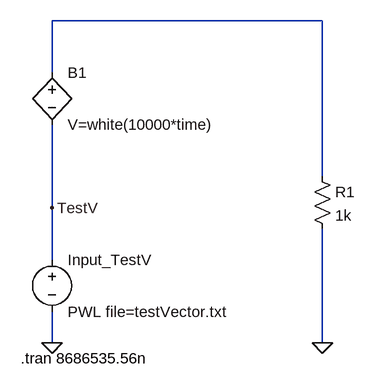
[diagram p0: schematic eye-diagram-pwl.asc]
eye-diagram-pwl.asc, the LTspice schematic file:
Version 4
SHEET 1 880 680
WIRE 464 -240 48 -240
WIRE 48 -160 48 -240
WIRE 464 0 464 -240
WIRE 48 48 48 -80
WIRE 48 128 48 48
WIRE 48 256 48 208
WIRE 464 256 464 80
FLAG 48 256 0
FLAG 48 48 TestV
FLAG 464 256 0
SYMBOL voltage 48 112 R0
WINDOW 123 0 0 Left 0
WINDOW 39 0 0 Left 0
SYMATTR InstName Input_TestV
SYMATTR Value PWL file=testVector.txt
SYMBOL res 448 -16 R0
SYMATTR InstName R1
SYMATTR Value 1k
SYMBOL bv 48 -176 R0
SYMATTR InstName B1
SYMATTR Value V=white(10000*time)
TEXT 0 280 Left 2 !.tran 8686535.56n

The netlist it stands for:
* eye-diagram-pwl.asc
V§Input_TestV TestV 0 PWL file=testVector.txt
R1 N001 0 1k
B1 N001 TestV V=white(10000*time)
.tran 8686535.56n
.backanno
.end